# Altium project Sch_Lout.PrjPcb
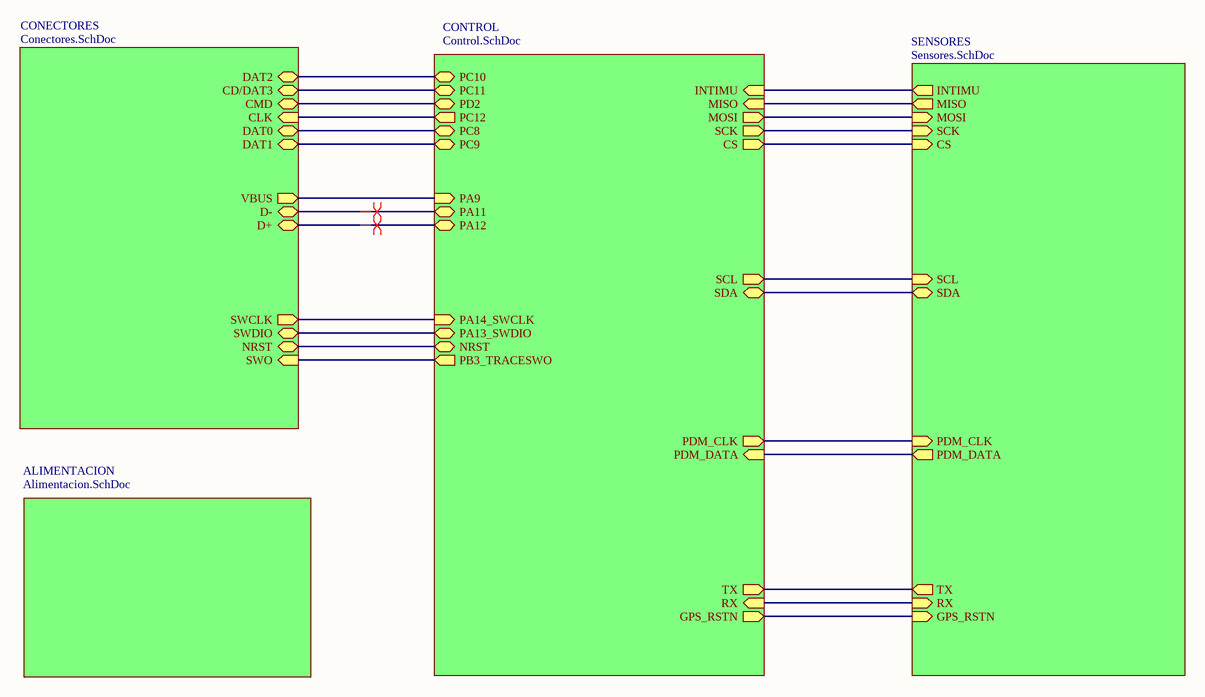
[diagram p0: main.SchDoc]
5 sheets, 56 parts. Net scope: hierarchical (ports join the sheet entries above them; power ports are global).
Board file: PCB1.PcbDoc
Sheets:
  main.SchDoc
    ALIMENTACION = Alimentacion.SchDoc
    CONTROL = Control.SchDoc
    SENSORES = Sensores.SchDoc
    CONECTORES = Conectores.SchDoc

## Sheet main.SchDoc
size A4; Author: Daniel Olsson & David Caballero; CompanyName: ETSIT; Organization: UPM; Revision: 1.1; SheetNumber: 1; SheetTotal: 2

### Sub-sheets
ALIMENTACION = Alimentacion.SchDoc: no entries
CONECTORES = Conectores.SchDoc: DAT2 (bidir), CD/DAT3 (bidir), CMD (bidir), CLK (in), DAT0 (bidir), DAT1 (bidir), VBUS (out), D- (bidir), D+ (bidir), SWCLK (out), SWDIO (bidir), NRST (bidir), SWO (in)
CONTROL = Control.SchDoc: PC12 (out), PC9 (bidir), PC8 (bidir), PD2 (bidir), PC11 (bidir), PC10 (bidir), PA9 (in), PA11 (bidir), PA12 (bidir), PA14_SWCLK (in), PA13_SWDIO (bidir), NRST (bidir), PB3_TRACESWO (out), INTIMU (in), MISO (in), MOSI (out), SCK (out), CS (out), SCL (out), SDA (bidir), PDM_CLK (out), PDM_DATA (in), TX (out), RX (in), GPS_RSTN (out)
SENSORES = Sensores.SchDoc: INTIMU (out), MISO (out), MOSI (in), SCK (in), CS (in), SCL (in), SDA (bidir), PDM_CLK (in), PDM_DATA (out), TX (out), RX (in), GPS_RSTN (in)

### Nets
NetC24_1: sheet CONTROL/NRST, sheet CONECTORES/NRST
NetD5_1: sheet CONTROL/PA12, sheet CONECTORES/D+
NetD5_3: sheet CONTROL/PA11, sheet CONECTORES/D-
NetJ1_1: sheet CONTROL/PC10, sheet CONECTORES/DAT2
NetJ1_2: sheet CONTROL/PC11, sheet CONECTORES/CD/DAT3
NetJ1_3: sheet CONTROL/PD2, sheet CONECTORES/CMD
NetJ1_5: sheet CONTROL/PC12, sheet CONECTORES/CLK
NetJ1_7: sheet CONTROL/PC8, sheet CONECTORES/DAT0
NetJ1_8: sheet CONTROL/PC9, sheet CONECTORES/DAT1
NetJ2_2: sheet CONTROL/PA14_SWCLK, sheet CONECTORES/SWCLK
NetJ2_4: sheet CONTROL/PA13_SWDIO, sheet CONECTORES/SWDIO
NetJ2_6: sheet CONTROL/PB3_TRACESWO, sheet CONECTORES/SWO
NetR13_2: sheet CONTROL/SCL, sheet SENSORES/SCL
NetR14_2: sheet CONTROL/SDA, sheet SENSORES/SDA
NetR16_1: sheet CONTROL/PA9, sheet CONECTORES/VBUS
NetU3_1: sheet CONTROL/MISO, sheet SENSORES/MISO
NetU3_2: sheet CONTROL/MOSI, sheet SENSORES/MOSI
NetU3_5: sheet CONTROL/INTIMU, sheet SENSORES/INTIMU
NetU3_10: sheet CONTROL/CS, sheet SENSORES/CS
NetU3_12: sheet CONTROL/SCK, sheet SENSORES/SCK
NetU5_1: sheet CONTROL/PDM_DATA, sheet SENSORES/PDM_DATA
NetU5_4: sheet CONTROL/PDM_CLK, sheet SENSORES/PDM_CLK
NetU6_1: sheet CONTROL/RX, sheet SENSORES/RX
NetU6_2: sheet CONTROL/TX, sheet SENSORES/TX
NetU6_10: sheet CONTROL/GPS_RSTN, sheet SENSORES/GPS_RSTN

### Layout directives
differential pair: NetD5_1, NetD5_3

### Notes on the sheet
- Title:
- Drawn By:
- Page Contents:
- Checked By:
- Size:
- Date:
- File:
- License:
- Email:
- A4
- Number:
- Time:
- Revision:
- Sheet
- Website:
- of

## Sheet Alimentacion.SchDoc
size A4; Date: 11/03/2026; Author: Daniel Olsson & David Caballero; CompanyName: UPM; DrawnBy: David & Daniel; Engineer: David & Daniel; Organization: ETSIT; Revision: V1; SheetNumber: 2; SheetTotal: 2
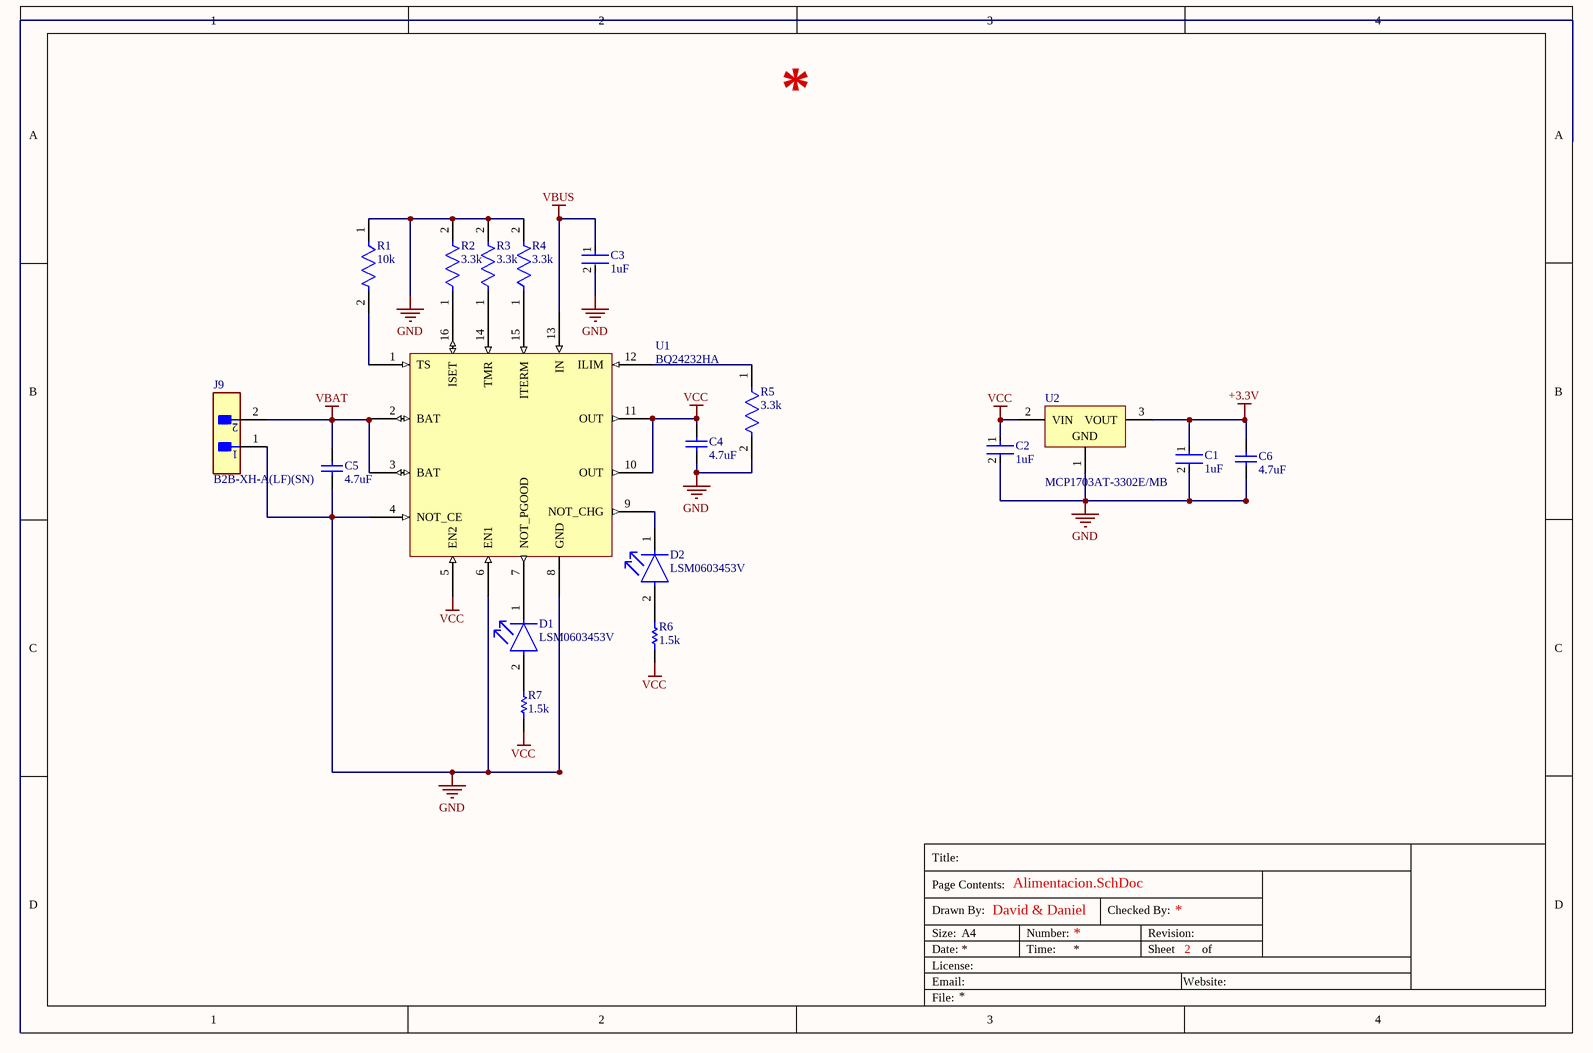
[diagram p1: Alimentacion.SchDoc]

### Parts
C1  1uF  [FP-CL10-IPC_C]
C2  1uF  [FP-CL10-IPC_C]
C3  1uF  [FP-CL10-IPC_C]
C4  4.7uF  [CAPC2014X150X70ML20]
C5  4.7uF  [CAPC2014X150X70ML20]
C6  4.7uF  [CAPC2014X150X70ML20]
D1  LSM0603453V  [FP-LSM0603453V-MFG]
D2  LSM0603453V  [FP-LSM0603453V-MFG]
J9  B2B-XH-A(LF)(SN)  [FP-B2B-XH-A_LF_SN-MFG]
R1  10k  [FP-CRCW0603-HPe3-MFG]
R2  3.3k  [FP-AC0603-IPC_C]
R3  3.3k  [FP-AC0603-IPC_C]
R4  3.3k  [FP-AC0603-IPC_C]
R5  3.3k  [FP-AC0603-IPC_C]
R6  1.5k  [RESC1608X55X25ML10T15]
R7  1.5k  [RESC1608X55X25ML10T15]
U1  BQ24232HA  [QFN50P300X300X100_HS-17N]
U2  MCP1703AT-3302E/MB  [MCHP-SOT-89-MB3_M]

### Nets
+3.3V: C1.1 C6.2 U2.3(VOUT)
GND: C1.2 C2.2 C3.2 C4.1 C5.1 C6.1 J9.1 R1.1 R2.2 R3.2 R4.2 R5.2 U1.4(NOT_CE) U1.6(EN1) U1.8(GND) U2.1(GND)
VBAT: C5.2 J9.2 U1.2(BAT) U1.3(BAT)
VBUS: C3.1 U1.13(IN)
VCC: C2.1 C4.2 R6.1 R7.1 U1.5(EN2) U1.10(OUT) U1.11(OUT) U2.2(VIN)
NetD1_1: D1.1(C) U1.7(NOT_PGOOD)
NetD1_2: D1.2(A) R7.2
NetD2_1: D2.1(C) U1.9(NOT_CHG)
NetD2_2: D2.2(A) R6.2
NetR1_2: R1.2 U1.1(TS)
NetR2_1: R2.1 U1.16(ISET)
NetR3_1: R3.1 U1.14(TMR)
NetR4_1: R4.1 U1.15(ITERM)
NetR5_1: R5.1 U1.12(ILIM)

### Notes on the sheet
- Title:
- Drawn By:
- Page Contents:
- Checked By:
- Size:
- Date:
- File:
- License:
- Email:
- A4
- Number:
- Time:
- Revision:
- Sheet
- Website:
- of

### Library data of the parts
C1-C3 = CMP-13271-002188-1: Cap Ceramic 1uF 16V X7R ±10% Pad SMD 0603 +125°C T/R; Width: 0.031inch; Max Operating Temperature: 125°C; Case/Package: 0603; Features: Soft Termination; Mount: Surface Mount; Min Operating Temperature: -55°C; Packaging: Tape and Reel; Dielectric: X7R; Voltage Rating: 16V; Capacitance: 1uF; Thickness: 0.035inch; Length: 0.063inch; Depth: 0.8mm; Lead Free: Lead Free; Tolerance: 10%; Ratings: AEC-Q200; Case Code (Imperial): 0603; Case Code (Metric): 1608
C4-C6 = CMP-2007-00037-1: Part Number: TACR475M010RTA; Manufacturer: AVX Interconnect / Elco
D1 D2 = CMP-00731-94024739-1: LSM0603453V LED SM 0603 3V -/1000/-mcd Green; Forward Current: 20mA; Forward Voltage: 2.3V; Viewing Angle: 120°; Reverse Voltage: 5V; Power Dissipation: 60mW; Wavelength: 576nm; Luminous Intensity: 120mcd; NexarPartId: 94024739; Height: 550µm; Max Operating Temperature: 85°C; Schedule B: 8541402000, 8541406050; Case/Package: 0603; Color: Green; Min Operating Temperature: -40°C
J9 = CMP-2000-05888-3: CONN HEADER VERT 2POS 2.5MM; Current Rating: 3A; Voltage Rating: 250V; Number of Contacts: 2; Contact Resistance: 20mR; Wire/Cable Gauge: 22AWG; Insulation Resistance: 1GR; Connector Type: Male Pin; Packaging: Bulk; Contact Material: Brass; Lead Free: Lead Free; Orientation: Straight; Contact Plating: Tin; Max Current Rating: 3A; Termination: Solder; Fastening Type: Detent; Depth: 5.75mm; Housing Material: Polyamide; REACH SVHC: No SVHC; Series: XH; Voltage Rating (AC): 250V; Number of Positions: 2; Color: Natural; Contact Type: Male Pin; Max Voltage Rating (DC): 250V; Pitch: 2.5mm; Lead Pitch: 2.5mm; Mount: Through Hole; Max Operating Temperature: 85°C; Length: 7.4mm; Max Voltage Rating (AC): 250V; Min Operating Temperature: -25°C; Number of Rows: 1; Housing Color: White
R1 = CMP-2000-03835-2: RES SMD 10K OHM 1% 1/3W 0603; Resistance: 10kR; Voltage Rating (DC): 75V; Max Power Dissipation: 250mW; Temperature Coefficient: 100ppm/°C; Case Code (Metric): 1608; Features: Automotive AEC-Q200; Termination: SMD/SMT; Number of Terminations: 2; Case Code (Imperial): 0603; Tolerance: 1%; Depth: 0.85mm; Package Quantity: 10; Length: 1.6mm; Packaging: Tape and Reel; Contact Plating: Tin; Radiation Hardening: No; Case/Package: 0603; Composition: Thick Film; Voltage Rating: 75V; Weight: 7.1E-05oz; Max Operating Temperature: 155°C; Lead Free: Lead Free; Width: 0.033inch; Power Rating: 250mW; Min Operating Temperature: -55°C; Military Standard: Not; Height: 0.45mm
R2-R5 = CMP-03412-041670-1: RES 3.3kΩ 1.00% 0.2W 0603; RoHS Compliant: Yes
R6 R7 = CMP-2000-04319-1: Part Number: RC0603JR-131K5L; Manufacturer: Yageo
U1 = BQ24232HA: USB-Friendly Lithium-Ion Battery Charger and Power-Path Management IC; ComponentLink1Description: New link; ComponentLink1URL: https://www.mouser.es/ProductDetail/Texas-Instruments/BQ24232HARGTR?qs=zEmsApcVOkUhMNqBs2s9Ww%3D%3D
U2 = CMP-0136-01169-1: 250 mA, 16V, Low Quiescent Current LDO Regulator, -40 to 125 degC, 3-pin SOT-89 (MB3), Tape and Reel; Manufacturer: Microchip; PackageVersion: C04-029B; ComponentLink3Description: Package Specification; PartNumber: MCP1703AT-3302E/MB; ComponentLink2URL: http://ww1.microchip.com/downloads/en/DeviceDoc/25122A.pdf; PackageDescription: 3-Lead Plastic Small Outline Transistor Header, 4.5 x 2.45 mm Body, 1.5 mm Pitch; PackageReference: SOT-89-MB3; ComponentLink1URL: http://www.microchip.com; ComponentLink2Description: Datasheet; ComponentLink3URL: http://www.microchip.com/stellent/groups/techpub_sg/documents/packagingspec/en012702.pdf; ComponentLink1Description: Manufacturer URL; ComponentLink4Description: Product URL; Mounting Technology: Surface Mount; DatasheetVersion: Rev. A; ComponentLink4URL: http://www.microchip.com/MCP1703A

## Sheet Control.SchDoc
size A4
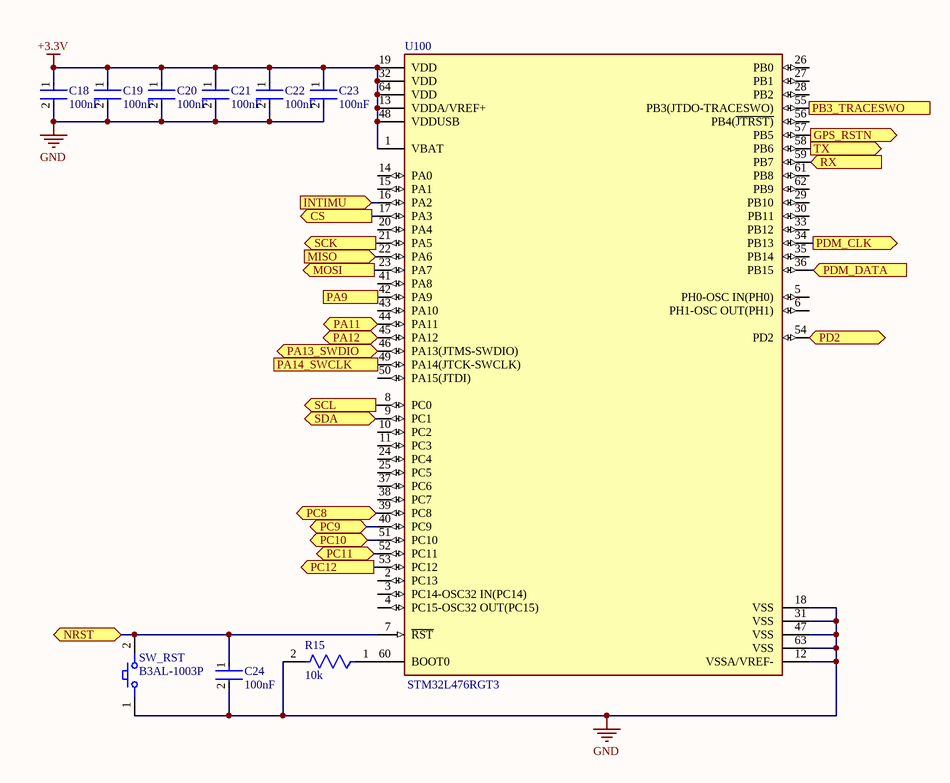
[diagram p2: Control.SchDoc]

### Parts
C18  100nF  [FP-GCG188-0_2-IPC_B]
C19  100nF  [FP-GCG188-0_2-IPC_B]
C20  100nF  [FP-GCG188-0_2-IPC_B]
C21  100nF  [FP-GCG188-0_2-IPC_B]
C22  100nF  [FP-GCG188-0_2-IPC_B]
C23  100nF  [FP-GCG188-0_2-IPC_B]
C24  100nF  [FP-GCG188-0_2-IPC_B]
R15  10k  [FP-CRCW0603-HPe3-MFG]
SW_RST  B3AL-1003P  [FP-B3AL-1003P-MFG]
U100  STM32L476RGT3  [FP-LQFP64-5W-IPC_C]

### Ports
CS (out), GPS_RSTN (out), INTIMU (in), MISO (in), MOSI (out), NRST (bidir), PA9 (in), PA11 (bidir), PA12 (bidir), PA13_SWDIO (bidir), PA14_SWCLK (in), PB3_TRACESWO (out), PC8 (bidir), PC9 (bidir), PC10 (bidir), PC11 (bidir), PC12 (out), PD2 (bidir), PDM_CLK (out), PDM_DATA (in), RX (in), SCK (out), SCL (out), SDA (bidir), TX (out)

### Nets
+3.3V: C18.1 C19.1 C20.1 C21.1 C22.1 C23.1 U100.1(VBAT) U100.13(VDDA/VREF+) U100.19(VDD) U100.32(VDD) U100.48(VDDUSB) U100.64(VDD)
GND: C18.2 C19.2 C20.2 C21.2 C22.2 C23.2 C24.2 R15.2 SW_RST.1 U100.12(VSSA/VREF-) U100.18(VSS) U100.31(VSS) U100.47(VSS) U100.63(VSS)
NetC24_1: C24.1 SW_RST.2 U100.7(~{RST}) ; port NRST
NetD5_1: U100.45(PA12) ; port PA12
NetD5_3: U100.44(PA11) ; port PA11
NetJ1_1: U100.51(PC10) ; port PC10
NetJ1_2: U100.52(PC11) ; port PC11
NetJ1_3: U100.54(PD2) ; port PD2
NetJ1_5: U100.53(PC12) ; port PC12
NetJ1_7: U100.39(PC8) ; port PC8
NetJ1_8: U100.40(PC9) ; port PC9
NetJ2_2: U100.49(PA14(JTCK-SWCLK)) ; port PA14_SWCLK
NetJ2_4: U100.46(PA13(JTMS-SWDIO)) ; port PA13_SWDIO
NetJ2_6: U100.55(PB3(JTDO-TRACESWO)) ; port PB3_TRACESWO
NetR13_2: U100.8(PC0) ; port SCL
NetR14_2: U100.9(PC1) ; port SDA
NetR15_1: R15.1 U100.60(BOOT0)
NetR16_1: U100.42(PA9) ; port PA9
NetU3_1: U100.22(PA6) ; port MISO
NetU3_2: U100.23(PA7) ; port MOSI
NetU3_5: U100.16(PA2) ; port INTIMU
NetU3_10: U100.17(PA3) ; port CS
NetU3_12: U100.21(PA5) ; port SCK
NetU5_1: U100.36(PB15) ; port PDM_DATA
NetU5_4: U100.34(PB13) ; port PDM_CLK
NetU6_1: U100.59(PB7) ; port RX
NetU6_2: U100.58(PB6) ; port TX
NetU6_10: U100.57(PB5) ; port GPS_RSTN

Not connected (* = marked no-connect by the designer): U100 2(PC13) 3(PC14-OSC32_IN(PC14)) 4(PC15-OSC32_OUT(PC15)) 5(PH0-OSC_IN(PH0)) 6(PH1-OSC_OUT(PH1)) 10(PC2) 11(PC3) 14(PA0) 15(PA1) 20(PA4) 24(PC4) 25(PC5) 26(PB0) 27(PB1) 28(PB2) 29(PB10) 30(PB11) 33(PB12) 35(PB14) 37(PC6) 38(PC7) 41(PA8) 43(PA10) 50(PA15(JTDI)) 56(PB4(~{JTRST)}) 61(PB8) 62(PB9)

### Notes on the sheet
- Title:
- Drawn By:
- Page Contents:
- Checked By:
- Size:
- Date:
- File:
- License:
- Email:
- A4
- Number:
- Time:
- Revision:
- Sheet
- Website:
- of

### Library data of the parts
C18-C24 = CMP-06035-011350-1: AgPd Termination Conductive Glue Mounting Chip Multilayer Ceramic Capacitors for Automotive 0.1uF with 20% as tolerance, 50V X8R 15%, 0603 Package
R15 = CMP-2000-03835-2: as R1 on sheet Alimentacion; Case Code (Metric): 1608; Features: Automotive AEC-Q200; Termination: SMD/SMT; Number of Terminations: 2; Case Code (Imperial): 0603; Tolerance: 1%; Depth: 0.85mm; Package Quantity: 10; Length: 1.6mm; Packaging: Tape and Reel; Contact Plating: Tin; Radiation Hardening: No; Case/Package: 0603; Composition: Thick Film; Voltage Rating: 75V; Weight: 7.1E-05oz; Max Operating Temperature: 155°C; Lead Free: Lead Free; Width: 0.033inch; Power Rating: 250mW; Min Operating Temperature: -55°C; Military Standard: Not; Height: 0.45mm
SW_RST = CMP-08834-000018-1: SWITCH TACTILE SPST-NO 0.05A 16V; Contact Resistance: 100mR; Illumination Type: Non-Illuminated; Electrical Life: 1000000Cycles; Switch Function: Off-Mom; Switch Travel: 1.3mm; Contact Current Rating: 50mA; Actuator Color: White; Operating Force: 3.5N; Throw Configuration: SPST; Package Quantity: 1; Orientation: Straight; Radiation Hardening: No; Packaging: Tape and Reel; Max Voltage Rating (DC): 16V; Mechanical Life: 1000000Cycles; Min Operating Temperature: -40°C; Depth: 6.6mm; Voltage Rating (DC): 16V; Contact Plating: Silver; Mount: Surface Mount; Series: B3AL; Termination: SMD/SMT; Max Current Rating: 50mA; RoHS Compliant: Yes; Max Operating Temperature: 90°C; Current Rating: 50mA; Length: 6.9mm; Weight: 0.18g
U100 = CMP-12105-000133-1: IC MCU 32BIT 1MB FLASH 64LQFP; Core Architecture: ARM; Frequency: 80MHz; Number of I/Os: 51; Peripherals: Brown-out Detect/Reset; Interface: I2C; Oscillator Type: Internal; Case/Package: LQFP; Memory Type: FLASH; Packaging: Tray; Min Operating Temperature: -40°C; Memory Size: 1MB; Max Operating Temperature: 125°C

## Sheet Sensores.SchDoc
size A4
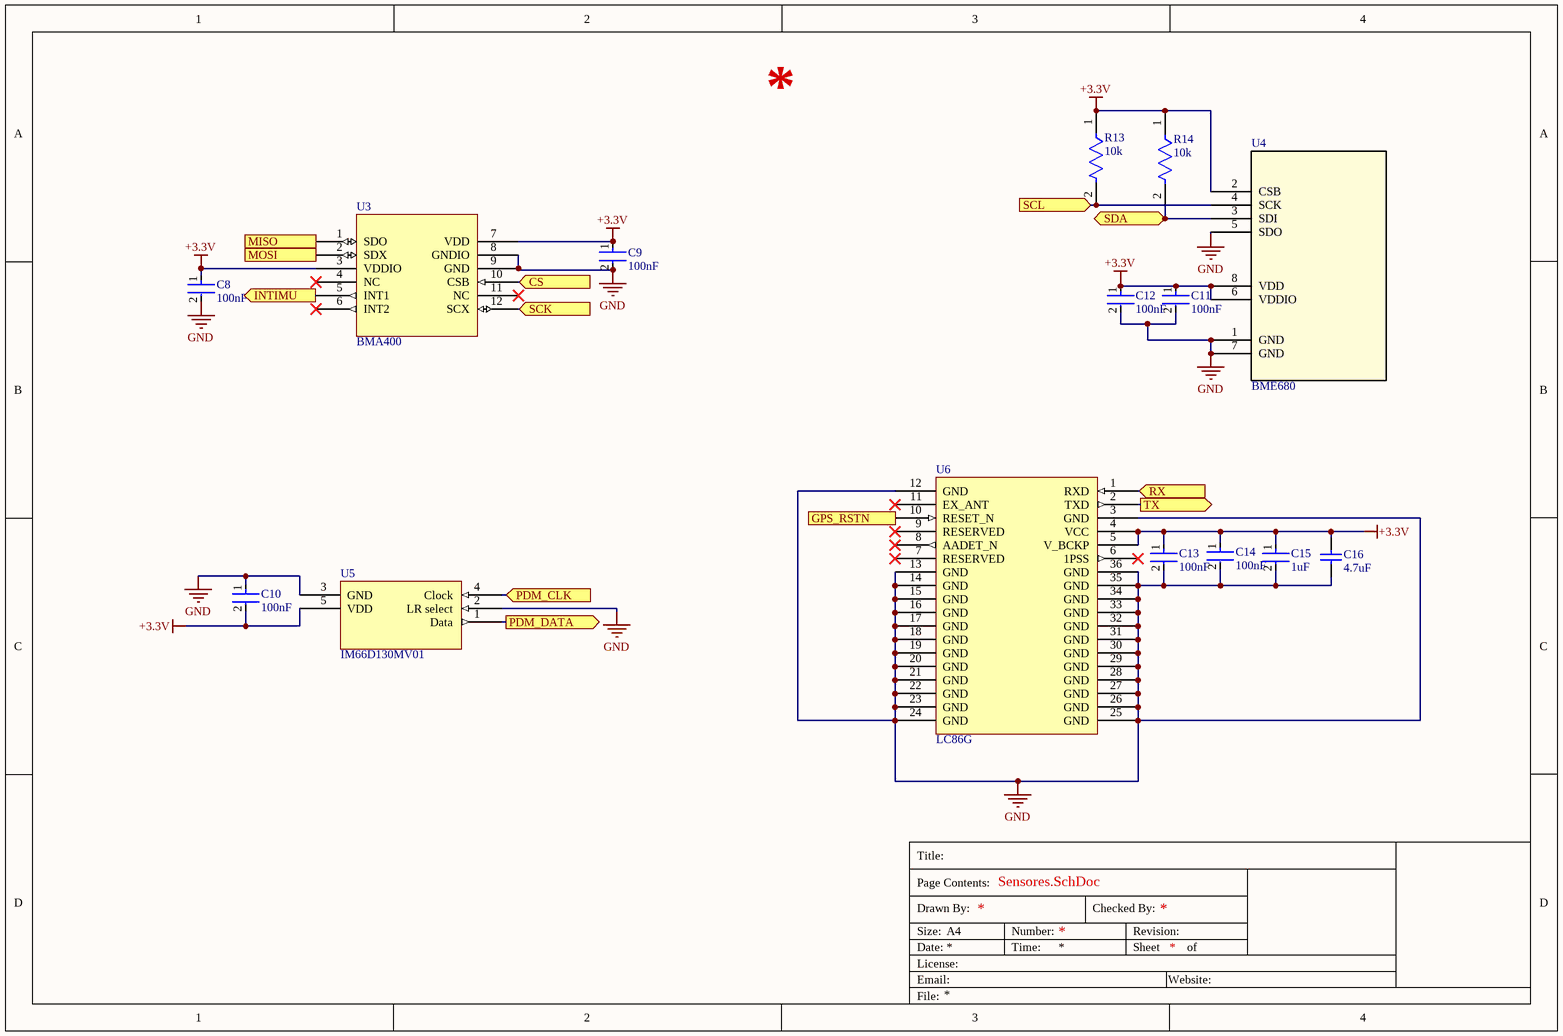
[diagram p3: Sensores.SchDoc]

### Parts
C8  100nF  [FP-GCG188-0_2-IPC_B]
C9  100nF  [FP-GCG188-0_2-IPC_B]
C10  100nF  [FP-GCG188-0_2-IPC_B]
C11  100nF  [FP-GCG188-0_2-IPC_B]
C12  100nF  [FP-GCG188-0_2-IPC_B]
C13  100nF  [FP-GCG188-0_2-IPC_B]
C14  100nF  [FP-GCG188-0_2-IPC_B]
C15  1uF  [FP-CL10-IPC_C]
C16  4.7uF  [CAPC2014X150X70ML20]
R13  10k  [FP-CRCW0603-HPe3-MFG]
R14  10k  [FP-CRCW0603-HPe3-MFG]
U3  BMA400  [LGA-12]
U4  BME680  [LGA8_BME680_BOS]
U5  IM66D130MV01  [IFX-PG-TLGA-5-8]
U6  LC86G  [LD86G]

### Ports
CS (in), GPS_RSTN (in), INTIMU (out), MISO (out), MOSI (in), PDM_CLK (in), PDM_DATA (out), RX (in), SCK (in), SCL (in), SDA (bidir), TX (out)

### Nets
+3.3V: C8.1 C9.1 C10.2 C11.1 C12.1 C13.1 C14.1 C15.1 C16.2 R13.1 R14.1 U3.3(VDDIO) U3.7(VDD) U4.2(CSB) U4.6(VDDIO) U4.8(VDD) U5.5(VDD) U6.4(VCC) U6.5(V_BCKP)
GND: C8.2 C9.2 C10.1 C11.2 C12.2 C13.2 C14.2 C15.2 C16.1 U3.8(GNDIO) U3.9(GND) U4.1(GND) U4.5(SDO) U4.7(GND) U5.2(LR_select) U5.3(GND) U6.3(GND) U6.12(GND) U6.13(GND) U6.14(GND) U6.15(GND) U6.16(GND) U6.17(GND) U6.18(GND) U6.19(GND) U6.20(GND) U6.21(GND) U6.22(GND) U6.23(GND) U6.24(GND) U6.25(GND) U6.26(GND) U6.27(GND) U6.28(GND) U6.29(GND) U6.30(GND) U6.31(GND) U6.32(GND) U6.33(GND) U6.34(GND) U6.35(GND) U6.36(GND)
NetR13_2: R13.2 U4.4(SCK) ; port SCL
NetR14_2: R14.2 U4.3(SDI) ; port SDA
NetU3_1: U3.1(SDO) ; port MISO
NetU3_2: U3.2(SDX) ; port MOSI
NetU3_5: U3.5(INT1) ; port INTIMU
NetU3_10: U3.10(CSB) ; port CS
NetU3_12: U3.12(SCX) ; port SCK
NetU5_1: U5.1(Data) ; port PDM_DATA
NetU5_4: U5.4(Clock) ; port PDM_CLK
NetU6_1: U6.1(RXD) ; port RX
NetU6_2: U6.2(TXD) ; port TX
NetU6_10: U6.10(RESET_N) ; port GPS_RSTN

Not connected (* = marked no-connect by the designer): U3 4(NC)* 6(INT2)* 11(NC)*; U6 6(1PSS)* 7(RESERVED)* 8(AADET_N)* 9(RESERVED)* 11(EX_ANT)*

### Notes on the sheet
- Title:
- Drawn By:
- Page Contents:
- Checked By:
- Size:
- Date:
- File:
- License:
- Email:
- A4
- Number:
- Time:
- Revision:
- Sheet
- Website:
- of

### Library data of the parts
C8-C14 = CMP-06035-011350-1: as C18 on sheet Control
C15 = CMP-13271-002188-1: as C1 on sheet Alimentacion; Width: 0.031inch; Max Operating Temperature: 125°C; Case/Package: 0603; Features: Soft Termination; Mount: Surface Mount; Min Operating Temperature: -55°C; Packaging: Tape and Reel; Dielectric: X7R; Voltage Rating: 16V; Capacitance: 1uF; Thickness: 0.035inch; Length: 0.063inch; Depth: 0.8mm; Lead Free: Lead Free; Tolerance: 10%; Ratings: AEC-Q200; Case Code (Imperial): 0603; Case Code (Metric): 1608
C16 = CMP-2007-00037-1: as C4 on sheet Alimentacion
R13 R14 = CMP-2000-03835-2: as R1 on sheet Alimentacion; Case Code (Metric): 1608; Features: Automotive AEC-Q200; Termination: SMD/SMT; Number of Terminations: 2; Case Code (Imperial): 0603; Tolerance: 1%; Depth: 0.85mm; Package Quantity: 10; Length: 1.6mm; Packaging: Tape and Reel; Contact Plating: Tin; Radiation Hardening: No; Case/Package: 0603; Composition: Thick Film; Voltage Rating: 75V; Weight: 7.1E-05oz; Max Operating Temperature: 155°C; Lead Free: Lead Free; Width: 0.033inch; Power Rating: 250mW; Min Operating Temperature: -55°C; Military Standard: Not; Height: 0.45mm
U4 = BME680: Description; Manufacturer_Name: Bosch Sensortec; Copyright: Copyright (C) 2025 Ultra Librarian. All rights reserved.; Manufacturer_Part_Number: BME680; RefDes: RefDes; Type: Type

## Sheet Conectores.SchDoc: Conectores
size A4; Date: 12/03/2026; Author: Daniel & David; CompanyName: UPM; DrawnBy: Daniel & David; Engineer: Daniel & David; Organization: ETSIT; Revision: V1
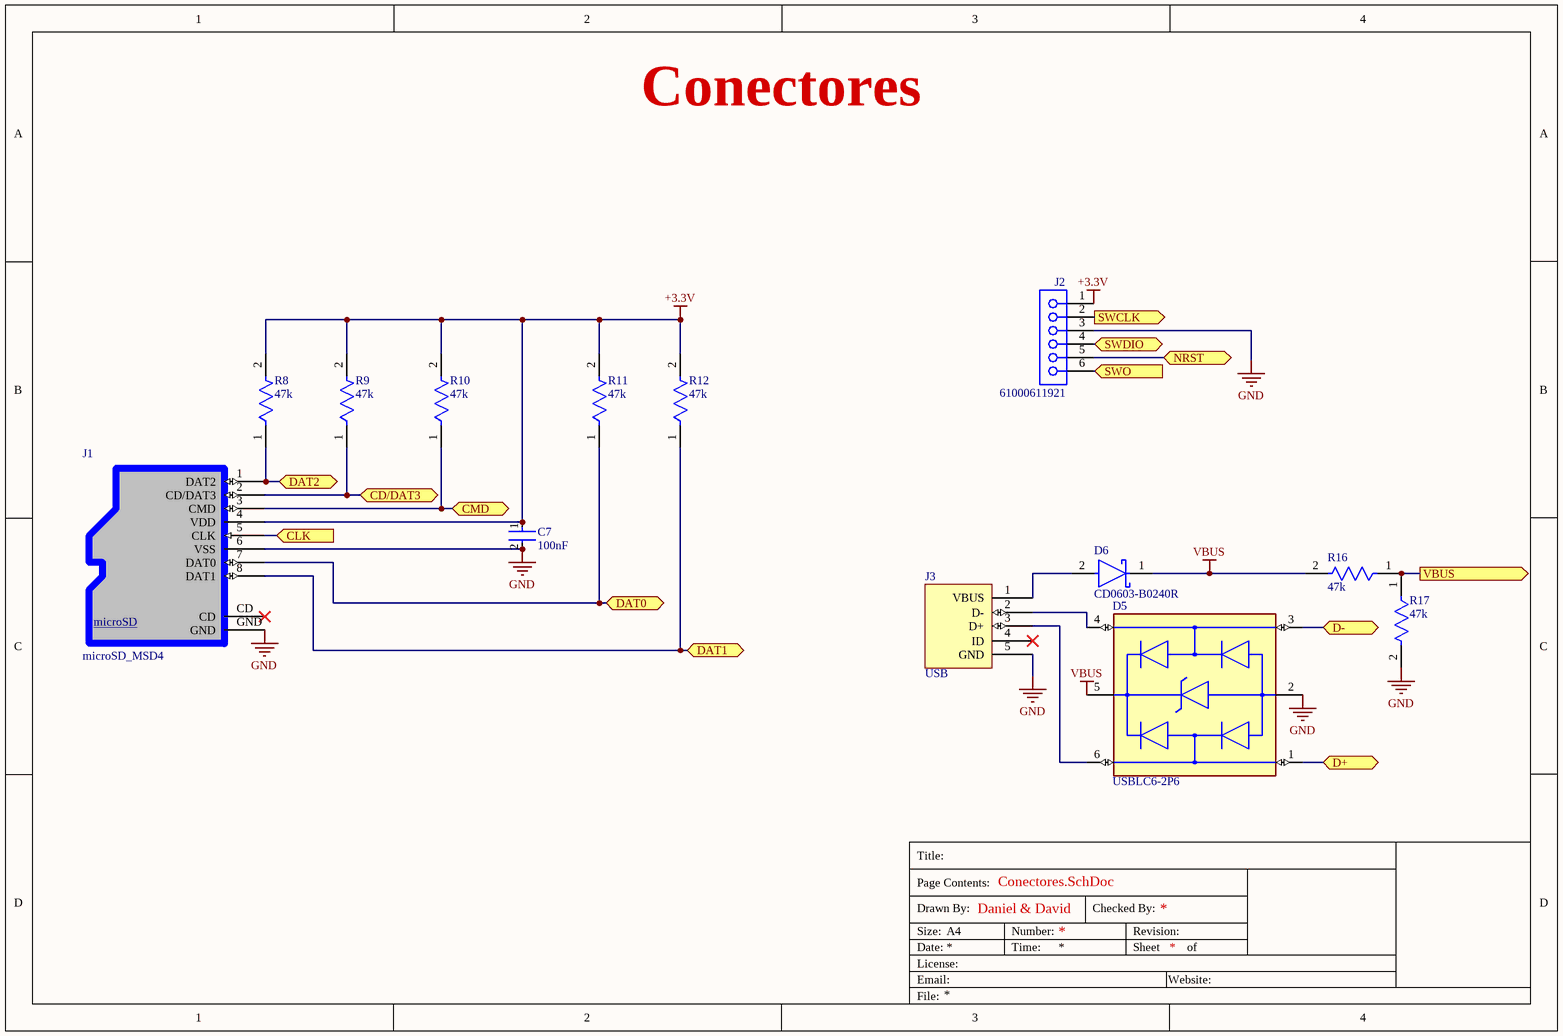
[diagram p4: Conectores.SchDoc]

### Parts
C7  100nF  [FP-GCG188-0_2-IPC_B]
D5  USBLC6-2P6  [FP-SOT-666-MFG]
D6  CD0603-B0240R  [FP-CD0603-MFG]
J1  microSD_MSD4  [ConnectorMicroSD_msd4]
J2  61000611921  [61000611921]
J3  USB  [ConnectorMicroUSB]
R8  47k  [FP-TFCR0603-IPC_A]
R9  47k  [FP-TFCR0603-IPC_A]
R10  47k  [FP-TFCR0603-IPC_A]
R11  47k  [FP-TFCR0603-IPC_A]
R12  47k  [FP-TFCR0603-IPC_A]
R16  47k  [FP-TFCR0603-IPC_A]
R17  47k  [FP-TFCR0603-IPC_A]

### Ports
CD/DAT3 (bidir), CLK (in), CMD (bidir), D+ (bidir), D- (bidir), DAT0 (bidir), DAT1 (bidir), DAT2 (bidir), NRST (bidir), SWCLK (out), SWDIO (bidir), SWO (in), VBUS (out)

### Nets
+3.3V: C7.1 J1.4(VDD) J2.1 R8.2 R9.2 R10.2 R11.2 R12.2
GND: C7.2 D5.2(GND) J1.6(VSS) J1.GND J2.3 J3.5(GND) R17.2
VBUS: D5.5(VBUS) D6.1(C) R16.2
NetC24_1: J2.5 ; port NRST
NetD5_1: D5.1(I/O1) ; port D+
NetD5_3: D5.3(I/O2) ; port D-
NetD5_4: D5.4(I/O2) J3.2(D-)
NetD5_6: D5.6(I/O1) J3.3(D+)
NetD6_2: D6.2(A) J3.1(VBUS)
NetJ1_1: J1.1(DAT2) R8.1 ; port DAT2
NetJ1_2: J1.2(CD/DAT3) R9.1 ; port CD/DAT3
NetJ1_3: J1.3(CMD) R10.1 ; port CMD
NetJ1_5: J1.5(CLK) ; port CLK
NetJ1_7: J1.7(DAT0) R11.1 ; port DAT0
NetJ1_8: J1.8(DAT1) R12.1 ; port DAT1
NetJ2_2: J2.2 ; port SWCLK
NetJ2_4: J2.4 ; port SWDIO
NetJ2_6: J2.6 ; port SWO
NetR16_1: R16.1 R17.1 ; port VBUS

Not connected (* = marked no-connect by the designer): J1 CD*; J3 4(ID)*

### Notes on the sheet
- Title:
- Drawn By:
- Page Contents:
- Checked By:
- Size:
- Date:
- File:
- License:
- Email:
- A4
- Number:
- Time:
- Revision:
- Sheet
- Website:
- of
- (in symbol microSD_MSD4) microSD

### Library data of the parts
C7 = CMP-06035-011350-1: as C18 on sheet Control
D5 = CMP-12225-000058-1: TVS DIODE 5.25V 17V SOT666; Min Breakdown Voltage: 6V; Power Line Protection: Yes; Element Configuration: Dual; Test Current: 1mA; Working Voltage: 5V; Number of Channels: 2; Max Reverse Leakage Current: 150nA; Direction: Unidirectional; Peak Pulse Current: 5A; Number of Elements: 1; Capacitance: 3.5pF; Max Breakdown Voltage: 6V; Height: 0.6mm; Depth: 1.3mm; Contact Plating: Tin; Reverse Breakdown Voltage: 6V; REACH SVHC: No SVHC; Operating Supply Voltage: 5V; Width: 1.3mm; Max Operating Temperature: 125°C; Reverse Standoff Voltage: 5V; ESD Protection: Yes; Package Quantity: 1; Termination: SMD/SMT; Length: 1.7mm; Leakage Current: 150nA; Number of Bidirectional Channels: 2; Case/Package: SOT-666; Min Operating Temperature: -40°C; Number of Pins: 6; Clamping Voltage: 17V; Breakdown Voltage: 6V; Lead Free: Lead Free; Radiation Hardening: No; Packaging: Tape and Reel; Mount: Surface Mount; Polarity: Unidirectional
D6 = CMP-07363-000001-1: DIODE SCHOTTKY 40V 200MA 0603; Manufacturer: Bourns; Standoff Height: 0.03mm; Max Surge Forward Current: 2A; Capacitance: 35pF; Max Junction Temp: +125°C; Value: 35pF; Peak Reverse Current: 0.5uA; Forward Current: 200mA; Max Repetitive Reverse Voltage: 40V; Mouser Description: Diode Small Signal Schottky 40V 0.2A Automotive 2-Pin Case 0603(1608Metric) T/R; ComponentLink2URL: https://bourns.com/data/global/pdfs/CD0603-B.pdf; ComponentLink2Description: Datasheet; Device Class L1: Discrete Semiconductors; Device Class L2: Diodes; Temperature: -40°C to +125°C; Automotive: No; Manufacturer Part Number: CD0603-B0240R; RoHS: TRUE; Height: 0.86mm; Octopart: https://octopart.com/cd0603-b0240r-bourns-87497736; Category: Diode; Temperature Range Low: -40°C; Digikey Description: DIODE SCHOTTKY 40V 200MA 0603; Device Class L3: Schottky Diodes; Temperature Range High: +125°C; Package: CD0603; Lead Free: Yes
J2 = CMP-1502-01270-4: SMT Vertical Socket Header WR-PHD, Pitch 2.54 mm, Single Row, 6 pins; Current Rating: 3A; Contact Resistance: 20mΩ; Operating Supply Voltage: 250V; Gender: Female; Lead Pitch: 2.54mm; Orientation: Vertical; Number of Pins: 6; RoHS: Non-Compliant
R8-R12 R16 R17 = CMP-250906-272076-1: RES Thin Film,  47kΩ, 1%, 0.1W, 100ppm/°C, 0603

## Nets that join several sheets
+3.3V: Alimentacion (C1.1 C6.2 U2.3), Control (12 pins), Sensores (19 pins), Conectores (8 pins)
GND: Alimentacion (16 pins), Control (14 pins), Sensores (42 pins), Conectores (7 pins)
VBUS: Alimentacion (C3.1 U1.13), Conectores (D5.5 D6.1 R16.2)
NetC24_1: Control (C24.1 SW_RST.2 U100.7), Conectores (J2.5)
NetD5_1: Control (U100.45), Conectores (D5.1)
NetD5_3: Control (U100.44), Conectores (D5.3)
NetJ1_1: Control (U100.51), Conectores (J1.1 R8.1)
NetJ1_2: Control (U100.52), Conectores (J1.2 R9.1)
NetJ1_3: Control (U100.54), Conectores (J1.3 R10.1)
NetJ1_5: Control (U100.53), Conectores (J1.5)
NetJ1_7: Control (U100.39), Conectores (J1.7 R11.1)
NetJ1_8: Control (U100.40), Conectores (J1.8 R12.1)
NetJ2_2: Control (U100.49), Conectores (J2.2)
NetJ2_4: Control (U100.46), Conectores (J2.4)
NetJ2_6: Control (U100.55), Conectores (J2.6)
NetR13_2: Control (U100.8), Sensores (R13.2 U4.4)
NetR14_2: Control (U100.9), Sensores (R14.2 U4.3)
NetR16_1: Control (U100.42), Conectores (R16.1 R17.1)
NetU3_1: Control (U100.22), Sensores (U3.1)
NetU3_2: Control (U100.23), Sensores (U3.2)
NetU3_5: Control (U100.16), Sensores (U3.5)
NetU3_10: Control (U100.17), Sensores (U3.10)
NetU3_12: Control (U100.21), Sensores (U3.12)
NetU5_1: Control (U100.36), Sensores (U5.1)
NetU5_4: Control (U100.34), Sensores (U5.4)
NetU6_1: Control (U100.59), Sensores (U6.1)
NetU6_2: Control (U100.58), Sensores (U6.2)
NetU6_10: Control (U100.57), Sensores (U6.10)